# Altium project Portablizer.PrjPcb
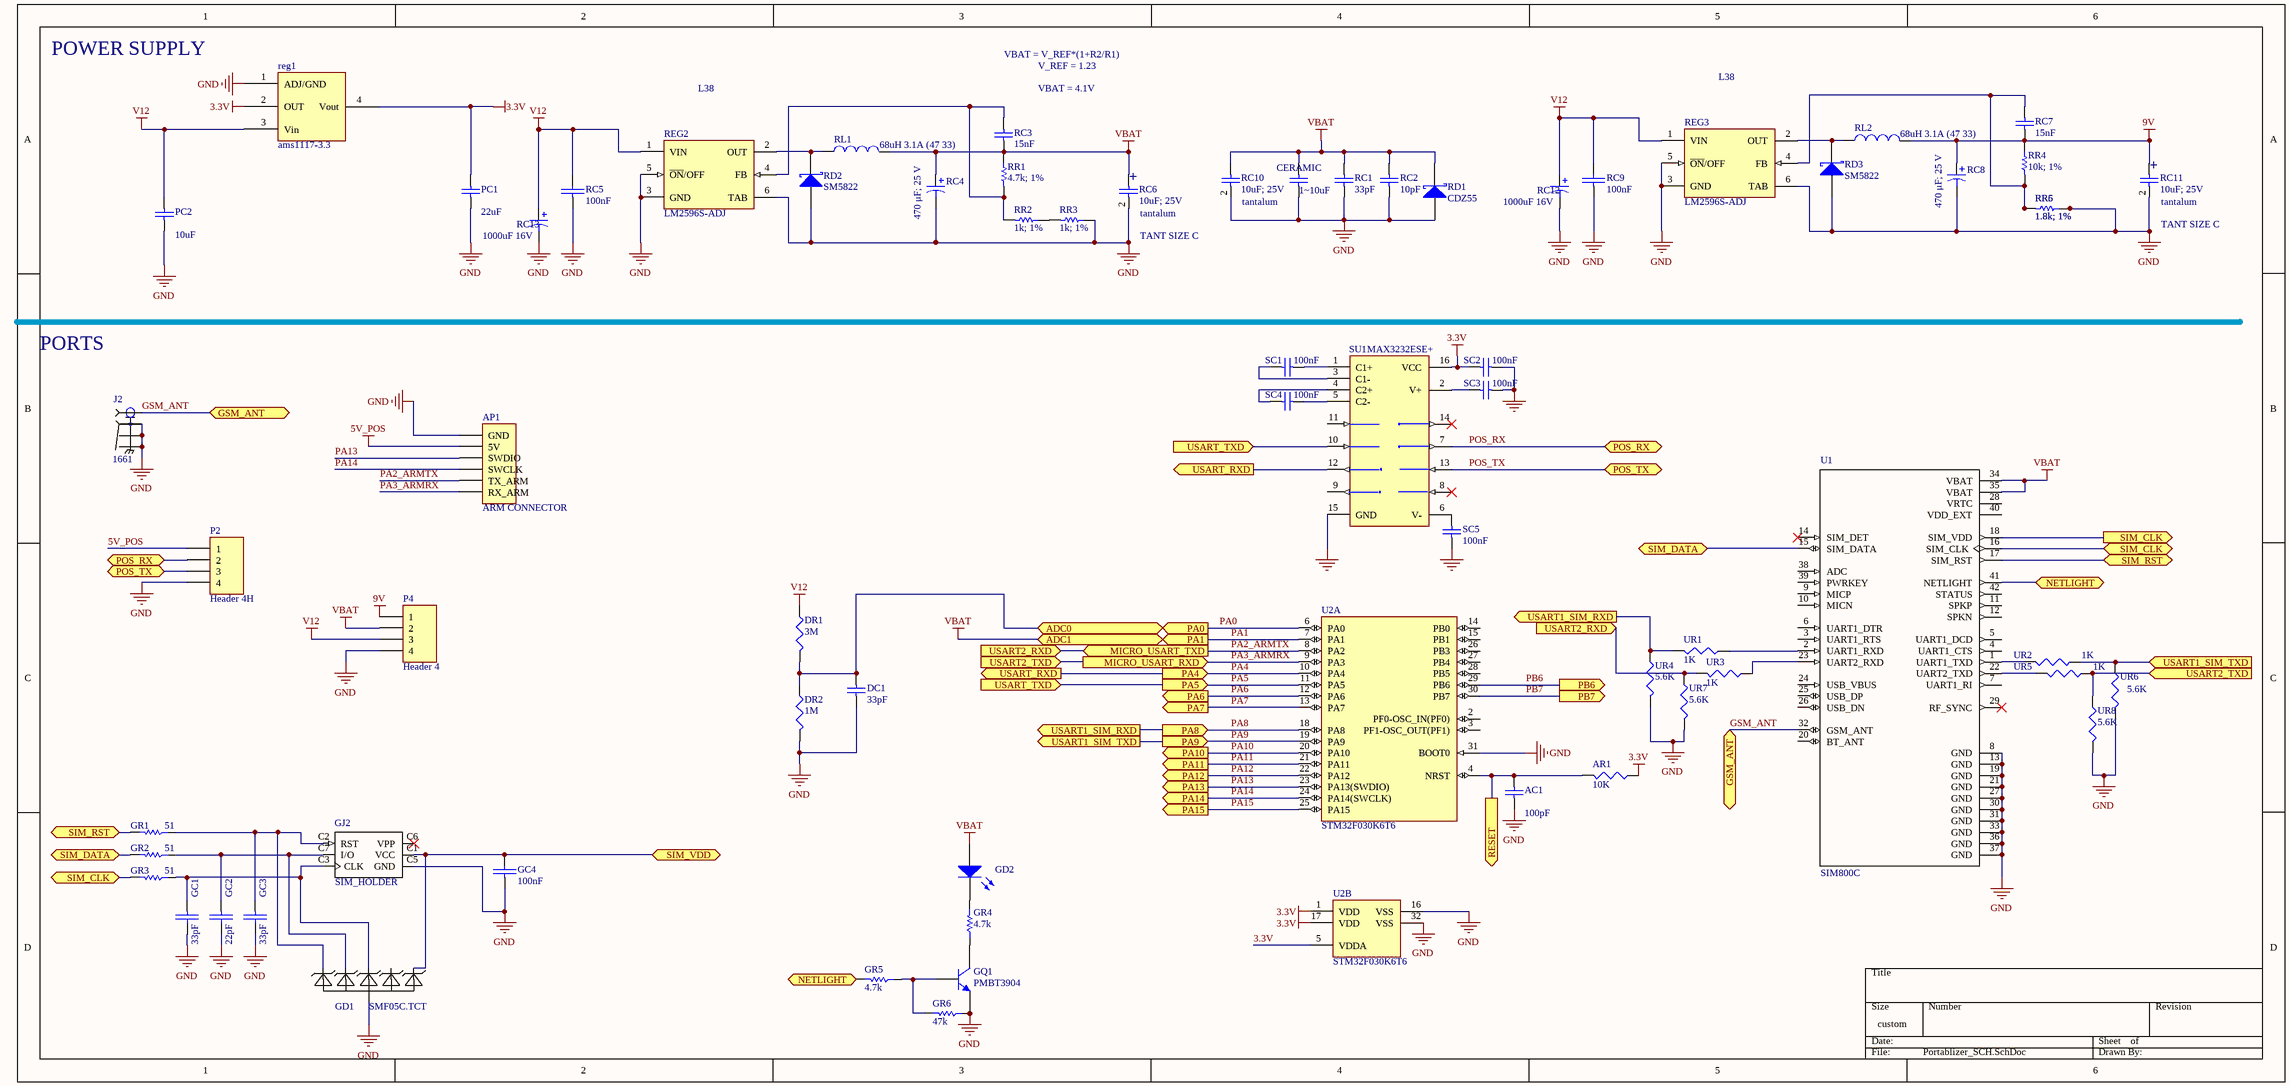
[diagram p0: Portablizer_SCH.SchDoc]
1 sheet, 69 parts. Net scope: flat (ports and power ports of the same name join across sheets).
Board file: Portablizer_PCB.PcbDoc

## Sheet Portablizer_SCH.SchDoc
size 508 x 241 mm

### Parts
AC1  value 100pF  [C1206]  (hidden comment: Cap Semi)
AP1  ARM CONNECTOR  [HDR1X6]
AR1  value 10K  [c1206]  (hidden comment: Res3)
CERAMIC  1~10uF  [C1206]
DC1  33pF  [C1206]
DR1  value 3M  [c1206]  (hidden comment: Res3)
DR2  value 1M  [c1206]  (hidden comment: Res3)
GC1  33pF  [C1206]
GC2  22pF  [C1206]
GC3  33pF  [C1206]
GC4  100nF  [C1206]
GD1  SMF05C.TCT  [SC70-6]
GD2  LED2  [C1206]  (value not drawn)
GJ2  SIM_HOLDER  [GCT_SIM2055-6-0-XX-00-X_REVI]
GQ1  PMBT3904  [SOT23_N]
GR1  51  [C1206]
GR2  51  [C1206]
GR3  51  [C1206]
GR4  4.7k  [C1206]
GR5  4.7k  [C1206]
GR6  47k  [C1206]
J2  1661  [MOLEX_1661]
P2  Header 4H  [HDR1X4H]
P4  Header 4  [HDR1X4]
PC1  value 22uF  [C1206]  (hidden comment: Cap Semi)
PC2  value 10uF  [C1206]  (hidden comment: PC1)
RC1  33pF  [C1206]
RC2  10pF  [C1206]
RC3  15nF  [C1206]
RC4  470 μF; 25 V  [WCAP-PSLC 10x12.4x4.5]
RC5  100nF  [C1206]
RC6  10uF; 25V  TYPE: tantalum  [CAPCP6032X280N]
RC7  15nF  [C1206]
RC8  470 μF; 25 V  [WCAP-PSLC 10x12.4x4.5]
RC9  100nF  [C1206]
RC10  10uF; 25V  TYPE: tantalum  [CAPCP6032X280N]
RC11  10uF; 25V  TYPE: tantalum  [CAPCP6032X280N]
RC12  1000uF 16V  [CAPR5-4X5]
RC13  1000uF 16V  [CAPR5-4X5]
RD1  CDZ55  [SMB]
RD2  SM5822  [SMB]
RD3  SM5822  [SMB]
reg1  ams1117-3.3  [SOT223_N]
REG2  LM2596S-ADJ  [TS5B_N]
REG3  LM2596S-ADJ  [TS5B_N]
RL1  68uH 3.1A (47 33)  [CAPR5-4X5]
RL2  68uH 3.1A (47 33)  [CAPR5-4X5]
RR1  4.7k; 1%  [C1206]
RR2  1k; 1%  [C1206]
RR3  1k; 1%  [C1206]
RR4  10k; 1%  [C1206]
RR5  1.8k; 1%  [C1206]
RR6  1.8k; 1%  [C1206]
SC1  100nF  [C1206]
SC2  100nF  [C1206]
SC3  100nF  [C1206]
SC4  100nF  [C1206]
SC5  100nF  [C1206]
SU1  MAX3232ESE+  [SO-16_N]
U1  SIM800C  [LCC110P1570X1760X250-42N]
U2  STM32F030K6T6  [STM-LQFP32_N]  (parts A,B of 2)
UR1  value 1K  [c1206]  (hidden comment: Res3)
UR2  value 1K  [c1206]  (hidden comment: Res3)
UR3  value 1K  [c1206]  (hidden comment: Res3)
UR4  value 5.6K  [c1206]  (hidden comment: Res3)
UR5  value 1K  [c1206]  (hidden comment: Res3)
UR6  value 5.6K  [c1206]  (hidden comment: Res3)
UR7  value 5.6K  [c1206]  (hidden comment: Res3)
UR8  value 5.6K  [c1206]  (hidden comment: Res3)

### Ports
ADC0, ADC1, GSM_ANT, MICRO_USART_RXD (out), MICRO_USART_TXD (in), NETLIGHT (bidir), PA0 (out), PA1 (out), PA4 (out), PA5 (out), PA6 (out), PA7 (out), PA8 (out), PA9 (out), PA10 (out), PA11 (out), PA12 (out), PA13 (out), PA14 (out), PA15 (out), PB6 (out), PB7 (out), POS_RX (bidir), POS_TX (bidir), RESET (out), SIM_CLK (bidir), SIM_CLK (out), SIM_DATA (bidir), SIM_RST (bidir), SIM_VDD, USART1_SIM_RXD (out), USART1_SIM_TXD (in), USART1_SIM_TXD (out), USART2_RXD (in), USART2_TXD (in), USART_RXD (out), USART_TXD (in)

### Nets
3.3V: AR1.1 PC1.1 reg1.2(OUT) reg1.4(Vout) SC2.2 SU1.16(VCC) U2.1(VDD) U2.5(VDDA) U2.17(VDD)
5V_POS: AP1.2(5V) P2.1
9V: P4.1 RC7.1 RC8.1 RC11.1 RL2.2 RR4.1
GND: AC1.2 AP1.1(GND) CERAMIC.1 DC1.1 DR2.2 GC1.1(+) GC2.1(+) GC3.1(+) GC4.2(-) GD1.2(A) GJ2.C5(GND) GQ1.2(E) GR6.1 J2.2(GND) J2.3(GND) J2.4(GND) P2.4 P4.4 PC1.2 PC2.2 RC1.1 RC2.1 RC4.2 RC5.2(-) RC6.2 RC8.2 RC9.2(-) RC10.2 RC11.2 RC12.2 RC13.2 RD1.1(A) RD2.1(A) RD3.1(A) reg1.1(ADJ/GND) REG2.3(GND) REG2.5(~{ON}/OFF) REG2.6(TAB) REG3.3(GND) REG3.5(~{ON}/OFF) REG3.6(TAB) RR3.1 RR5.1 RR6.1 SC2.1 SC3.2 SC5.1 SU1.15(GND) U1.8(GND) U1.13(GND) U1.19(GND) U1.21(GND) U1.27(GND) U1.30(GND) U1.31(GND) U1.33(GND) U1.36(GND) U1.37(GND) U2.16(VSS) U2.31(BOOT0) U2.32(VSS) UR4.2 UR6.2 UR7.2 UR8.2
PA1: CERAMIC.2 GD2.1(A) P4.2 RC1.2 RC2.2 RC3.1 RC4.1 RC6.1 RC10.1 RD1.2(K) RL1.2 RR1.1 U1.34(VBAT) U1.35(VBAT) U2.7(PA1) ; port PA1, port ADC1  [also labelled VBAT]
V12: DR1.1 P4.3 PC2.1 RC5.1(+) RC9.1(+) RC12.1 RC13.1 reg1.3(Vin) REG2.1(VIN) REG3.1(VIN)
GSM_ANT: J2.1(SIG) U1.32(GSM_ANT) ; port GSM_ANT
PA0: DC1.2 DR1.2 DR2.1 U2.6(PA0) ; port PA0, port ADC0
PA2_ARMTX: AP1.5(TX_ARM) U2.8(PA2) UR3.2 UR7.1 ; port MICRO_USART_TXD, port USART2_RXD
PA3_ARMRX: AP1.6(RX_ARM) U2.9(PA3) UR5.1 UR8.1 ; port MICRO_USART_RXD, port USART2_TXD
PA4: SU1.12(R1OUT) U2.10(PA4) ; port USART_RXD, port PA4
PA5: SU1.10(T2IN) U2.11(PA5) ; port USART_TXD, port PA5
PA6: U2.12(PA6) ; port PA6
PA7: U2.13(PA7) ; port PA7
PA8: U2.18(PA8) UR1.2 UR4.1 ; port PA8, port USART1_SIM_RXD
PA9: U2.19(PA9) UR2.1 UR6.1 ; port USART1_SIM_TXD, port PA9
PA10: U2.20(PA10) ; port PA10
PA11: U2.21(PA11) ; port PA11
PA12: U2.22(PA12) ; port PA12
PA13: AP1.3(SWDIO) U2.23(PA13(SWDIO)) ; port PA13
PA14: AP1.4(SWCLK) U2.24(PA14(SWCLK)) ; port PA14
PA15: U2.25(PA15) ; port PA15
PB6: U2.29(PB6) ; port PB6
PB7: U2.30(PB7) ; port PB7
POS_RX: P2.2 SU1.7(T2OUT) ; port POS_RX
POS_TX: P2.3 SU1.13(R1IN) ; port POS_TX
NetAC1_1: AC1.1 AR1.2 U2.4(NRST) ; port RESET
NetGC1_2: GC1.2(-) GD1.4(C3) GJ2.C3(CLK) GR3.1
NetGC2_2: GC2.2(-) GD1.3(C2) GJ2.C7(I/O) GR2.1
NetGC3_2: GC3.2(-) GD1.1(C1) GJ2.C2(RST) GR1.1
NetGC4_1: GC4.1(+) GD1.6(C5) GJ2.C1(VCC) ; port SIM_VDD
NetGD2_2: GD2.2(K) GR4.2
NetGQ1_1: GQ1.1(B) GR5.1 GR6.2
NetGQ1_3: GQ1.3(C) GR4.1
NetGR1_2: GR1.2 U1.17(SIM_RST) ; port SIM_RST
NetGR2_2: GR2.2 U1.15(SIM_DATA) ; port SIM_DATA
NetGR3_2: GR3.2 U1.16(SIM_CLK) U1.18(SIM_VDD) ; port SIM_CLK
NetGR5_2: GR5.2 U1.41(NETLIGHT) ; port NETLIGHT
NetRC3_2: RC3.2 REG2.4(FB) RR1.2 RR2.2
NetRC7_2: RC7.2 REG3.4(FB) RR4.2 RR5.2 RR6.2
NetRD2_2: RD2.2(K) REG2.2(OUT) RL1.1
NetRD3_2: RD3.2(K) REG3.2(OUT) RL2.1
NetRR2_1: RR2.1 RR3.2
NetSC1_1: SC1.1 SU1.3(C1-)
NetSC1_2: SC1.2 SU1.1(C1+)
NetSC3_1: SC3.1 SU1.2(V+)
NetSC4_1: SC4.1 SU1.4(C2+)
NetSC4_2: SC4.2 SU1.5(C2-)
NetSC5_2: SC5.2 SU1.6(V-)
NetU1_1: U1.1(UART1_TXD) UR2.2
NetU1_2: U1.2(UART1_RXD) UR1.1
NetU1_22: U1.22(UART2_TXD) UR5.2
NetU1_23: U1.23(UART2_RXD) UR3.1

Not connected (* = marked no-connect by the designer): GD1 5(C4); GJ2 C6(VPP)*; SU1 8(R2IN)* 9(R2OUT) 11(T1IN) 14(T1OUT)*; U1 3(UART1_RTS) 4(UART1_CTS) 5(UART1_DCD) 6(UART1_DTR) 7(UART1_RI) 9(MICP) 10(MICN) 11(SPKP) 12(SPKN) 14(SIM_DET)* 20(BT_ANT) 24(USB_VBUS) 25(USB_DP) 26(USB_DN) 28(VRTC) 29(RF_SYNC)* 38(ADC) 39(PWRKEY) 40(VDD_EXT) 42(STATUS); U2 2(PF0-OSC_IN(PF0)) 3(PF1-OSC_OUT(PF1)) 14(PB0) 15(PB1) 26(PB3) 27(PB4) 28(PB5)

### Notes on the sheet
- POWER SUPPLY
- VBAT = V_REF*(1+R2/R1)
- V_REF = 1.23
- L38
- VBAT = 4.1V
- (near RC6) +
- (near RC11) +
- TANT SIZE C
- (near RC11) TANT SIZE C
- PORTS

### Library data of the parts
AC1 PC1 PC2 = Cap Semi: Capacitor (Semiconductor SIM Model); Published: 8-Jun-2000; LatestRevisionDate: 29-May-2009; LatestRevisionNote: IPC-7351 Footprint Added.; PackageReference: C1206; Publisher: Altium Limited; PackageDescription: Chip Capacitor
AP1 = Header 6: Header, 6-Pin; LatestRevisionDate: 17-Jul-2002; LatestRevisionNote: Re-released for DXP Platform.; Publisher: Altium Limited
AR1 DR1 DR2 UR1-UR8 = Res3: Resistor; Published: 8-Jun-2000; LatestRevisionDate: 29-May-2009; LatestRevisionNote: IPC-7351 Footprint Added.; PackageReference: J1-0603; Publisher: Altium Limited; PackageDescription: Chip Resistor
CERAMIC DC1 RC1-RC3 RC6 RC7 RC10 RC11 = Cap: Capacitor; STATE: NOT-AVAILABLE; Published: 8-Jun-2000; LatestRevisionDate: 17-Jul-2002; LatestRevisionNote: Re-released for DXP Platform.; PackageReference: RAD-0.3; Publisher: Altium Limited; PackageDescription: Radial Cap, Thru-Hole; 2 Leads; 0.3 in Pin Spacing
  CERAMIC DC1 RC1-RC3 RC7: TYPE: tantalum
GC1-GC4 RC5 RC9 = Cap-Bipolar: Bipolar Capacitor; Voltage: 100V; Designer: Saeid Jorablo; Organazation: ControTec; Adding Date: 1387/12/20
  GC1 GC3: Value: 33pF
  GC2: Value: 22pF
  GC4 RC5 RC9: Value: 100nF
GD1 = SMF05C.TCT: MF: Semtech; Price: None; Package: SOT-363 Diodes Inc.; Availability: Unavailable; MP: SMF05C.TCT; Value: *
GD2 = LED2: Typical RED, GREEN, YELLOW, AMBER GaAs LED; Published: 8-Jun-2000; LatestRevisionDate: 17-Jul-2002; LatestRevisionNote: Re-released for DXP Platform.; PackageVersion: Feb-2002; PackageReference: 3.2X1.6X1.1; Publisher: Altium Limited; PackageDescription: SM LED; 2 Flat Leads
GJ2 = SIM5051-6-0-18-00-X_REVF: Memory Socket, Sim Card, 6pos; MF: Global Connector Technology; MP: SIM5051-6-0-18-00-A REV C; Price: None; Package: None; Availability: Unavailable; Value: *
GQ1 = PMBT3904: NPN Switching Transistor; Published: 17-Sep-2003; LatestRevisionDate: 12-Dec-2006; LatestRevisionNote: IPC-7351 Footprint Added.; DatasheetVersion: 27-Apr-1999; PackageVersion: May-1999; PackageReference: SOT23; Publisher: Altium Limited; PackageDescription: 3-Pin SOT-23 Package 0.95 mm Pitch, 2.3 mm Lead Span; ComponentLink1Description: Manufacturer Link; ComponentLink1URL: http://www.semiconductors.philips.com/; ComponentLink2Description: Datasheet; ComponentLink2URL: http://www.semiconductors.philips.com/acrobat/datasheets/PMBT3904_4.pdf
GR1-GR6 = Resistor
  GR1-GR3: Value: 51
  GR4 GR5: Value: 4.7k
  GR6: Value: 47k
J2 = 1661: uFL SMT Antenna Connector; MF: Keystone Electronics; Availability: Unavailable; Package: None; SnapEDA_Link: https://www.snapeda.com/parts/1661/Keystone%20Electronics/view-part/?ref=snap; Price: None; MP: 1661; Value: *
P2 = Header 4H: Header, 4-Pin, Right Angle; LatestRevisionDate: 17-Jul-2002; LatestRevisionNote: Re-released for DXP Platform.; Publisher: Altium Limited
P4 = Header 4: Header, 4-Pin; LatestRevisionDate: 17-Jul-2002; LatestRevisionNote: Re-released for DXP Platform.; Publisher: Altium Limited
RC4 RC8 = WCAP-PSLC 10x12.4x4.5 875075361006: WCAP-PSLC Aluminum Polymer Capacitors , 680 μF; + / - 20%; 16 V , 10 x 12,4; Manufacturer: Wurth Elektronik; E-mail: libraries@we-online.com; Capacitance: 680 μF; Characteristics: Aluminum Polymer Capacitors; Recommended soldering: Reflow; Operating temperature: –55 °C to +105 °C; Large capacitance SMD product series; Very low ESR at high frequency range; High permissible ripple current; Long life and high reliability; Load life: 2000 h @ +105 °C; ComponentLink1Description: Manufacturer; ComponentLink1URL: http://www.we-online.com; ComponentLink2Description: Datasheet; ComponentLink2URL: http://katalog.we-online.de/pbs/datasheet/875075361006.pdf; Created by: Karrer Zheng; Created Date: 6/8/2015; Application: Low voltage port filtering, appplid to high-end switching power supply, PC(desktop,laptop ),industrial computer, VGA card, server power, charger, TV, digital set-top box,DC-DC power module, game machine etc which consume large current with high speed circuit.; partNo: 875075361006
RC12 RC13 = Cap Pol1: Polarized Capacitor (Radial); Value: 100pF; Published: 8-Jun-2000; LatestRevisionDate: 17-Jul-2002; LatestRevisionNote: Re-released for DXP Platform.; PackageReference: RB7.6-15; Publisher: Altium Limited; PackageDescription: Polarized Capacitor (Radial); 2 Leads
RD1-RD3 = D Schottky: Schottky Diode; Published: 8-Jun-2000; LatestRevisionDate: 17-Jul-2002; LatestRevisionNote: Re-released for DXP Platform.; PackageReference: SMB; Publisher: Altium Limited; PackageDescription: DO-214-AA/SMB; 2 C-Bend Leads; Body 5.3 x 3.6 mm, inc. leads (LxW); Code_JEDEC: DO-214-AA
REG2 REG3 = LM2596S-ADJ: SIMPLE SWITCHER® Power Converter 150 KHz 3A Step-Down Voltage Regulator, 5-pin TO-263; Manufacturer: National Semiconductor; PackageTopMarking: NSUZXYTTE#*LM2596S*-ADJ P+; PowerWise: N; Published: 4-Dec-2008; DatasheetVersion: May-2002; PackageVersion: revD, Apr-2005; PackageReference: TS5B; Publisher: Altium Limited; PackageDescription: TO-263, Molded, .400 x .390 x .180in, 5 Lead, .067in Pitch, Surface Mount; Supplier 1: Farnell; Supplier Part Number 1: 1523864; Supplier 2: Farnell; Supplier Part Number 2: 9494367; PartNumber: LM2596S-ADJ; RoHS: N; PinCount: 5; CompType: Switcher; Code_JEDEC: MO-169-AB; ComponentLink1Description: LM2596 Datasheet; ComponentLink1URL: http://www.national.com/ds/LM/LM2596.pdf; ComponentLink2Description: LM2596 Web Page; ComponentLink2URL: http://www.national.com/pf/LM/LM2596.html; ComponentLink3Description: TS5B Package Page; ComponentLink3URL: http://www.national.com/packaging/folders/ts5b.html
RL1 RL2 = Inductor: Code_IEC: 1005; Value: 10mH; Published: 8-Jun-2000; LatestRevisionDate: 29-May-2009; LatestRevisionNote: IPC-7351 Footprint Added.; PackageReference: 0402-A; Publisher: Altium Limited; PackageDescription: Chip Inductor; Code_JEITA: 0402
RR1-RR6 = Res1: Resistor; Published: 8-Jun-2000; LatestRevisionDate: 17-Jul-2002; LatestRevisionNote: Re-released for DXP Platform.; PackageReference: AXIAL-0.3; Publisher: Altium Limited; PackageDescription: Axial Device, Thru-Hole; 2 Leads; 0.3 in Pin Spacing
  RR1: Value: 4.7k; 1%
  RR2 RR3: Value: 1k; 1%
  RR4: Value: 10k; 1%
  RR5 RR6: Value: 1.8k; 1%
SC1-SC5 = Cap Semi: Capacitor; Tolerance: 10%; Dielectric: X7R; Company: AVX; Foreign Supplyer: False; Value: 100nF; Category: Capacitor; Subcategory: Ceramic; Package: 0603; Part Number: *; Voltage: *; Power: *
SU1 = MAX3232CSE: 3.0V TO 5.5V, Low-Power, up to 1Mbps, True RS-232 Transceiver Using Four 0.1µF External Capacitor; Company: MAXIM; Foreign Supplyer: False; Category: IC; Subcategory: MAX; Dielectric: *; Package: SO16; Part Number: MAX3232ESE+; Power.: *; Tolerance: *; Value: MAX3232ESE+; Voltage: *
U1 = SIM800C: Module: GSM/Bluetooth; GPRS; 2G; 1800MHz, 900MHz; 85.6kbps; SMD; MF: Simcom; Price: None; Availability: Unavailable; Package: None; SnapEDA_Link: https://www.snapeda.com/parts/SIM800C/Simcom/view-part/?ref=snap; MP: SIM800C; Value: *
U2 = STM32F030K6T6: ARM Cortex-M0 32-bit MCU, 32 KB Flash, 4 KB Internal RAM, 26 I/Os, 32-pin LQFP, -40 to 85 degC, Tray; FLASH Size (Prog) (kB): 32; I/Os (High Current): 26; Internal RAM Size (kB): 4; Operating Frequency(F) (Processor speed) (MHz): 48; Supply Voltage(Vcc) min (V): 2.4; DatasheetVersion: Rev. 1; PackageVersion: Rev. 1, 07/2013; PackageReference: LQFP32; PackageDescription: 32-Pin Low Profile Quad Flat Package, 7 x 7 mm Body, 0.8 mm Pitch; Supplier 1: Digi-Key; Supplier Part Number 1: 497-14046-ND; Supplier 2: Newark; Supplier Part Number 2: 19X6194; Supplier 3: Mouser; Supplier Part Number 3: 511-STM32F030K6T6; Core: ARM Cortex-M0; Packing: Tray; Mounting Technology: Surface Mount; PartNumber: STM32F030K6T6; ComponentLink1Description: Manufacturer URL; ComponentLink1URL: http://www.st.com/web/en/home.html; ComponentLink2Description: Datasheet; ComponentLink2URL: http://www.st.com/st-web-ui/static/active/en/resource/technical/document/datasheet/DM00088500.pdf; ComponentLink3Description: Package Specification; ComponentLink3URL: http://www.st.com/st-web-ui/static/active/en/resource/technical/document/datasheet/DM00088500.pdf